# EAGLE design GUC_KATMANI (EAGLE 8.5.1)
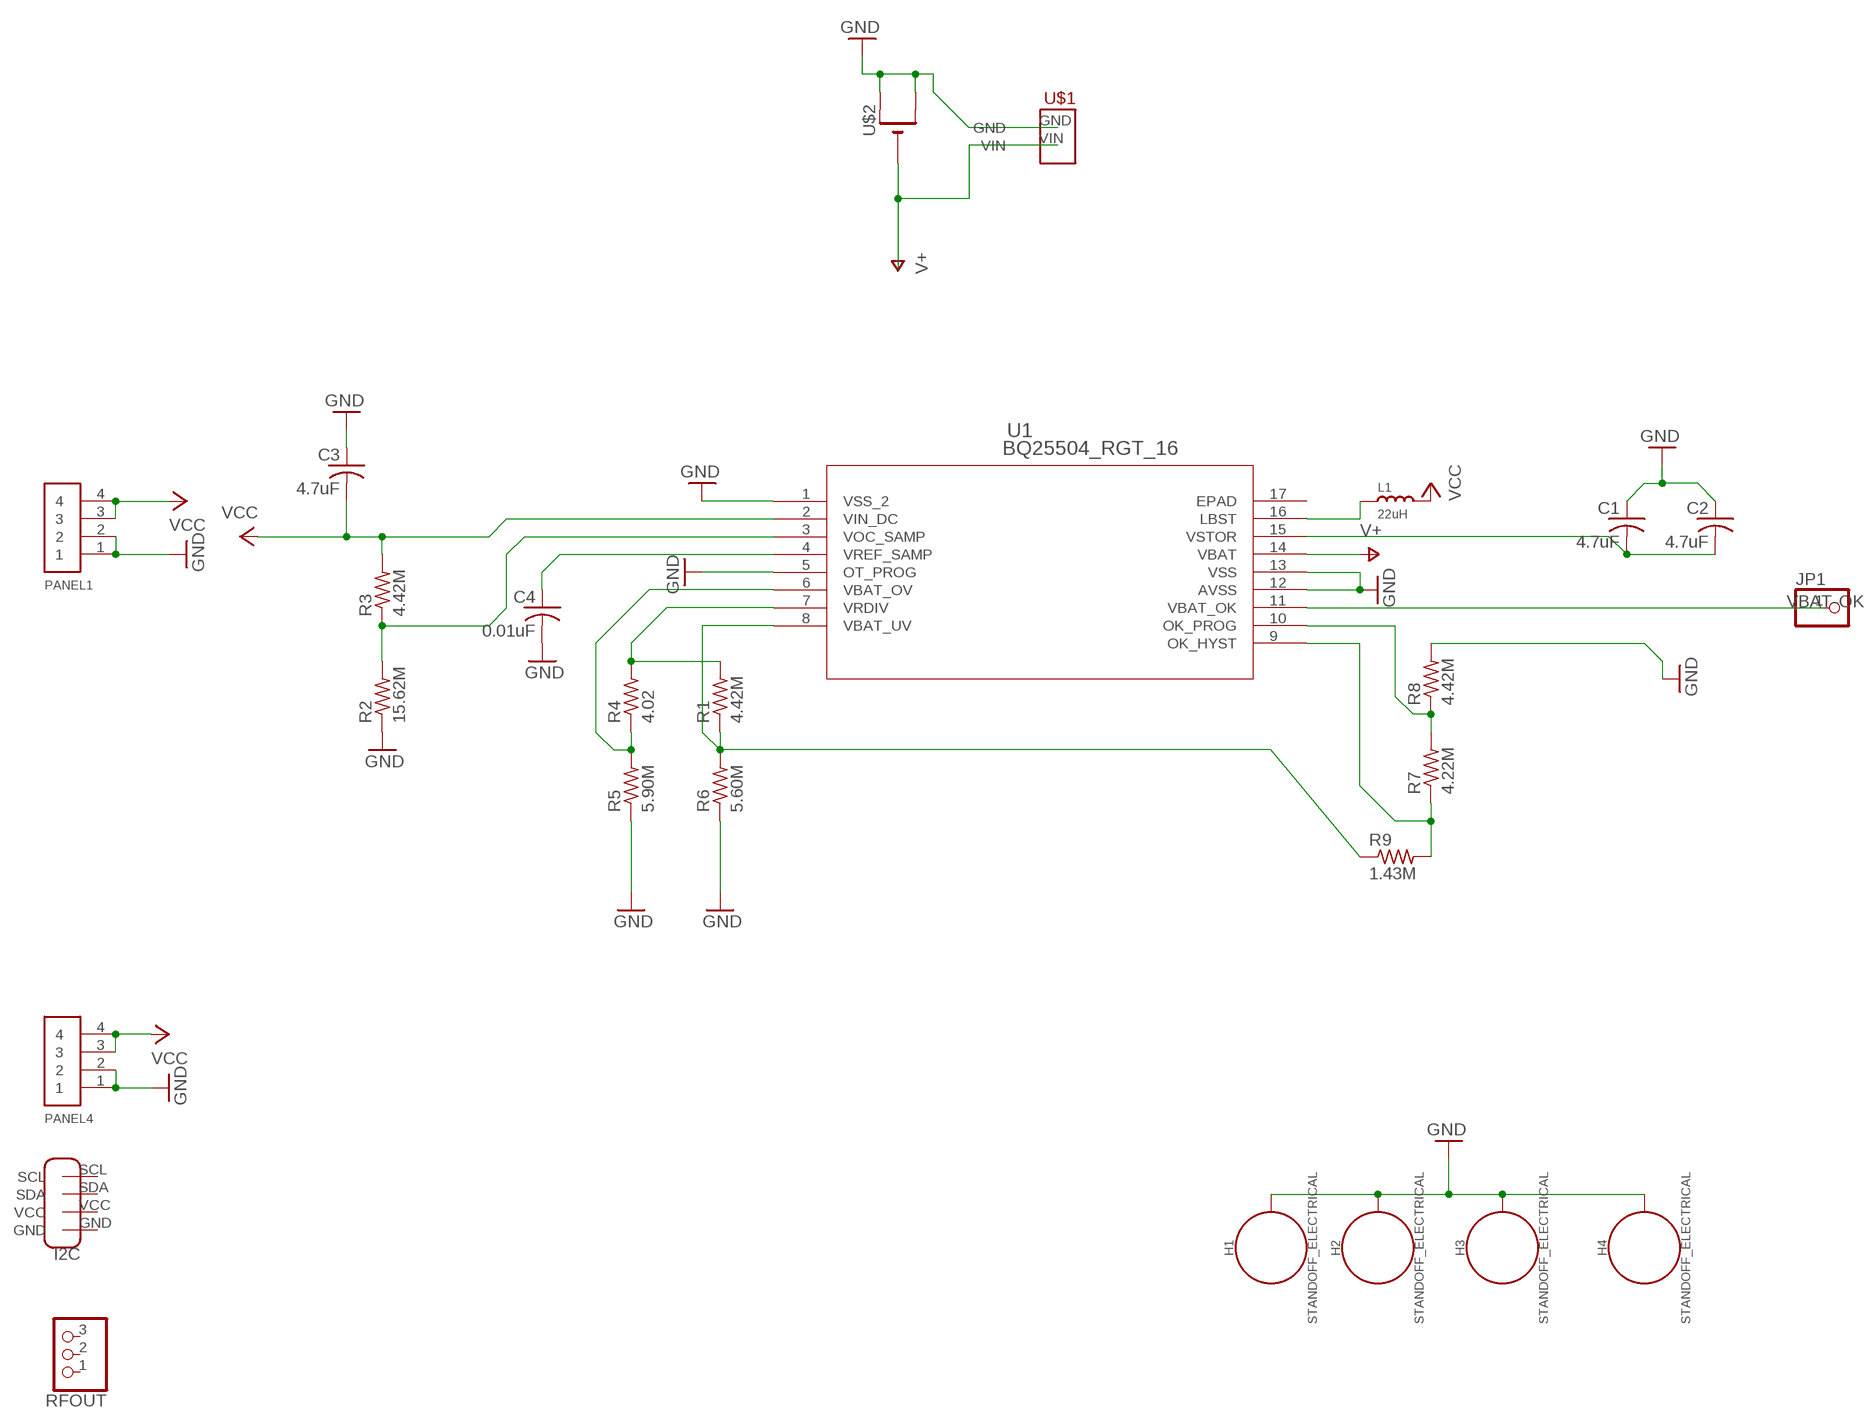
[diagram p0: schematic, sheet 1]

## Parts
C1  4.7uF  C-USC0805K  [C0805K]
C2  4.7uF  C-USC0805K  [C0805K]
C3  4.7uF  C-USC0805K  [C0805K]
C4  0.01uF  C-USC0805K  [C0805K]
H1  STANDOFF_ELECTRICAL  [STANDOFF-ELECTRICAL]
H2  STANDOFF_ELECTRICAL  [STANDOFF-ELECTRICAL]
H3  STANDOFF_ELECTRICAL  [STANDOFF-ELECTRICAL]
H4  STANDOFF_ELECTRICAL  [STANDOFF-ELECTRICAL]
JP1  PINHD-1X1CB  [1X01-CLEANBIG]
L1  22uH  SMD-FERRITE-BEAD-330R-1500MA(0805)'0805'  [L0805]
PANEL1  1X4-CLEANBIG  [1X04-CLEANBIG]
PANEL4  1X4-CLEANBIG  [1X04-CLEANBIG]
R1  4.42M  R-US_R0805  [R0805]
R2  15.62M  R-US_R0805  [R0805]
R3  4.42M  R-US_R0805  [R0805]
R4  4.02  R-US_R0805  [R0805]
R5  5.90M  R-US_R0805  [R0805]
R6  5.60M  R-US_R0805  [R0805]
R7  4.22M  R-US_R0805  [R0805]
R8  4.42M  R-US_R0805  [R0805]
R9  1.43M  R-US_R0805  [R0805]
RFOUT  PINHD-1X3CB  [1X03-CLEANBIG]
U1  BQ25504_RGT_16  [RGT16_1P7X1P7]
U$1  2PINKLEMENS  [2PINKLEMENS]
U$2  CR1220SMT  [CR1220-SMD]
U$3  I2C  [I2C]

## Nets
GND: C1.1 C2.1 C3.1 C4.2 H1.P1 H2.P1 H3.P1 H4.P1 PANEL1.1 PANEL1.2 PANEL4.1 PANEL4.2 R2.1 R5.1 R6.1 R8.2 U1.1(VSS_2) U1.5(OT_PROG) U1.12(AVSS) U1.13(VSS) U$1.GND U$2.+$1(+) U$2.+$2(+1)
N$1: R2.2 R3.1 U1.3(VOC_SAMP)
N$4: C4.1 U1.4(VREF_SAMP)
N$6: R4.1 R5.2 U1.6(VBAT_OV)
N$7: R1.2 R4.2 U1.7(VRDIV)
N$8: R1.1 R6.2 R9.1 U1.8(VBAT_UV)
N$13: R7.2 R8.1 U1.10(OK_PROG)
N$16: L1.1 U1.16(LBST)
N$18: R7.1 R9.2 U1.9(OK_HYST)
N$22: C1.2 C2.2 U1.15(VSTOR)
V+: U1.14(VBAT) U$1.VIN U$2.-
VBAT-OK: JP1.1 U1.11(VBAT_OK)
VCC: C3.2 L1.2 PANEL1.3 PANEL1.4 PANEL4.3 PANEL4.4 R3.2 U1.2(VIN_DC)
Unconnected: RFOUT.1 RFOUT.2 RFOUT.3 U$3.GND U$3.SCL U$3.SDA U$3.VCC

## Power pins joined to a net without a drawn wire
EPAD: U1.17(EPAD)

## Library data of the parts
C1-C4 = adafruit:C-US: CAPACITOR, American symbol
H1-H4 = SparkFun-Hardware:STANDOFF_ELECTRICAL: Stand Off Drill holes with an electrical connection. For example, use these to ground your board to a chassis. Example SparkFun Products Screw - Phillips Head (1/4", 4-40, 10 pack) <https://www.sparkfun.com/products/10453> (PRT-10453) Screw - Phillips Head (1/2", 4-40, 10 pack) <https://www.sparkfun.com/products/10452> (PRT-10452) Screw - Phillips Head (3/4", 4-40, 10 pack) <https://www.sparkfun.com/products/10451> (PRT-10451) Screw - Phillips Head (1", 4-40, 10 pack) <https://www.sparkfun.com/products/10450> (PRT-10450)
JP1 = adafruit:PINHD-1X1: Pin header 1x1 for 0.1" spacing With round pins
L1 = Seeed-Inductor:SMD-FERRITE-BEAD-330R-1500MA(0805): 303030006; MPN: BLM21PG331SN1D; VALUE: 330R-1500MA
PANEL1 PANEL4 = adafruit:1X4: 4-pin connector
R1-R9 = adafruit:R-US_: RESISTOR, American symbol
RFOUT = adafruit:PINHD-1X3: PIN HEADER
U1 = BQ25504:BQ25504_RGT_16; DATASHEETURL: httpwww.ti.comlitgpnBQ25504; FAMILY_NAME: BATTERY CHARGE MANAGEMENT; GENERIC_PART_NUMBER: BQ25504; INDUSTRY_STD_PKG_TYPE: QFN; MANUFACTURER: Texas Instruments; PACKAGE_DESIGNATOR: RGT; PIN_COUNT: 16
U$1 = 0000000111111aaa:2PINKLEMENS: 2 pin klemens denemem
U$2 = adafruit:CR1220: CR1216/CR1220/CR1225 12mm 3V lithium coin cell Great for battery packup. Both SMT and THM holders. Note the THM package has the ground pads on both sides of the PCB so that the masks are the same - this reduces the cost
U$3 = 0000000111111aaa:I2C

## Board
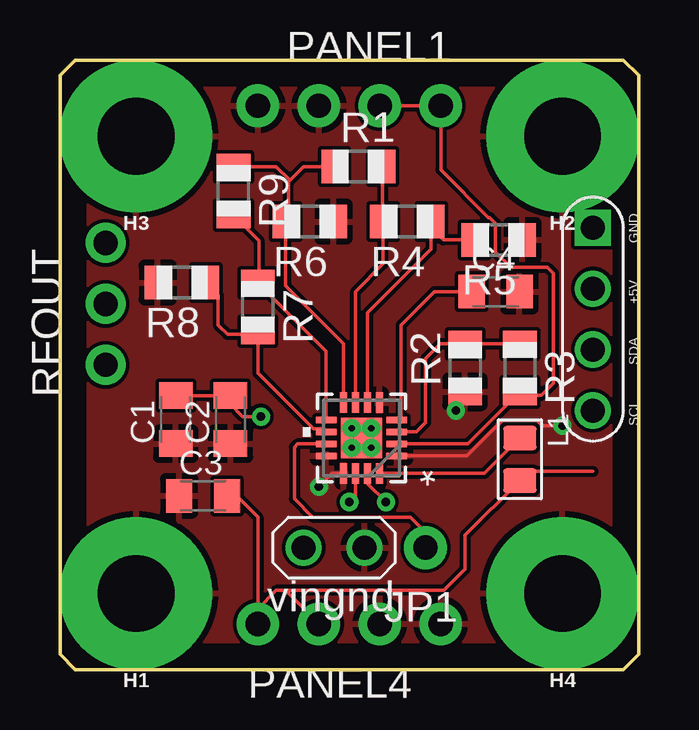
[diagram p1: board, top side]
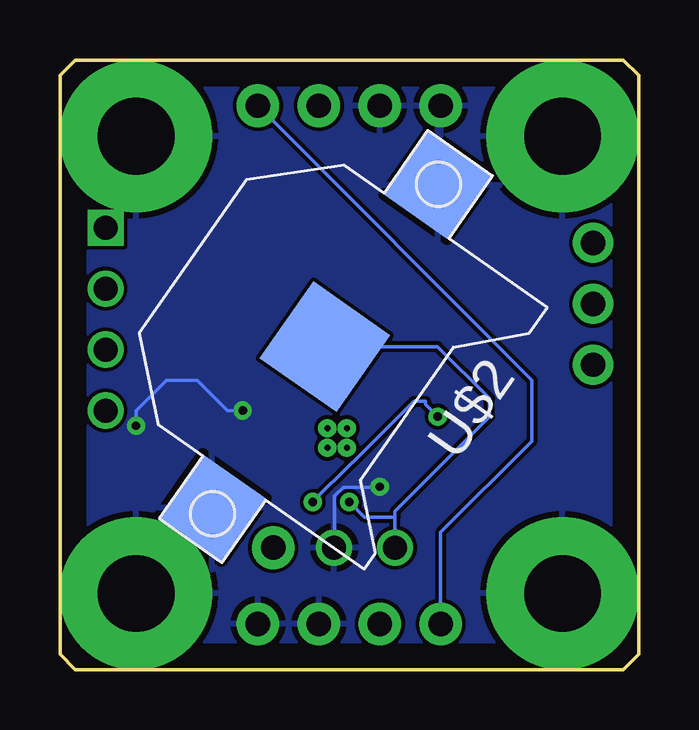
[diagram p2: board, bottom side, seen from below]

Size 24.13 x 25.4 mm. Coordinates in mm from the lower left corner, seen from the top.
Outline: 24.13,0.63 23.5,0 0.63,0 0,0.63 0,24.77 0.63,25.4 23.5,25.4 24.13,24.77 24.13,0.63
Copper layers (1*16): Top 0.035mm / dielectric 1.5mm / Bottom 0.035mm
Design rules "default": minimum track width 6mil, minimum drill 0.35mm, track to track 6mil, track to pad 6mil, pad to pad 6mil, via to via 6mil, smd to smd 6mil, copper to edge 40mil, drill to drill 6mil, minimum pad ring 10mil, minimum via ring 8mil, stop-mask expansion 4mil, vias tented up to drill 0mil, thermal gap 10mil

### Footprints (pad centres in the part's own frame; a part is rotated, then mirrored left to right if it is on the bottom)
C0805K = smd 1.1 x 1.4: 1 -1,0; 2 1,0
STANDOFF-ELECTRICAL = drill 3.2 pad 6.35: P1 0,0
1X01-CLEANBIG = drill 1.016 pad 1.778: 1 0,0
L0805 = smd 1.016 x 1.397: 1 -0.889,0; 2 0.889,0
1X04-CLEANBIG = drill 1.016 pad 1.778: 1 -3.81,0; 2 -1.27,0; 3 1.27,0; 4 3.81,0
R0805 = smd 1.1 x 1.4: 1 -1,0; 2 1,0
1X03-CLEANBIG = drill 1.016 pad 1.676: 1 -2.54,0; 2 0,0; 3 2.54,0
RGT16_1P7X1P7 = smd 0.85 x 0.28: 1 -1.475,0.75; 2 -1.475,0.25; 3 -1.475,-0.25; 4 -1.475,-0.75; 9 1.475,-0.75; 10 1.475,-0.25; 11 1.475,0.25; 12 1.475,0.75 | smd 0.28 x 0.85: 5 -0.75,-1.475; 6 -0.25,-1.475; 7 0.25,-1.475; 8 0.75,-1.475; 13 0.75,1.475; 14 0.25,1.475; 15 -0.25,1.475; 16 -0.75,1.475 | smd 1.7 x 1.7: 17 0,0 | drill 0.254 pad 0.508: V -0.406,-0.406; V_1 -0.406,0.406; V_2 0.406,-0.406; V_3 0.406,0.406
2PINKLEMENS = drill 1: GND 1.27,0; VIN -1.27,0
CR1220-SMD = smd 3.2 x 3.2: +$1 -8.2,0; +$2 8.2,0 | smd 3.9 x 3.9: - 0,0
I2C = drill 1 square: GND -2.54,0 | drill 1: SCL 5.08,0; SDA 2.54,0; VCC 0,0

### Placement (x,y rotation side)
C1  4.83,10.41 90 top
C2  7.11,10.41 90 top
C3  5.97,7.24 0 top
C4  18.16,15.75 0 top
H1  3.17,3.18 180 top
H2  20.95,22.22 180 top
H3  3.17,22.22 180 top
H4  20.95,3.18 180 top
JP1  15.24,5.08 180 top
L1  19.18,8.76 270 top
PANEL1  12.06,23.5 0 top
PANEL4  12.06,1.91 180 top
R1  12.45,20.95 0 top
R2  16.89,12.57 90 top
R3  19.18,12.57 270 top
R4  14.48,18.67 180 top
R5  18.29,17.91 180 top
R6  10.41,18.67 180 top
R7  8.26,15.11 270 top
R8  5.08,16.13 180 top
R9  7.24,19.94 270 top
RFOUT  1.91,15.24 90 top
U1  12.57,9.65 180 top
U$1  11.43,5.08 0 top
U$2  13.08,13.46 235 bottom
U$3  22.23,15.88 270 top

### Tracks (layer width: path | path; a pad name or v marks a point on that pad's centre or on a via)
GND  (via drill 0.35)
  Top 0.152: U1.13 11.35,8.18 v10.8,7.62 | v20.95,10.16 20.12,10.16 19.9,10.39 18.46,10.39 16.97,8.9 U1.1 | R2.1 16.51,11.19 v16.51,10.8
  Bottom 0.152: U$1.GND 12.67,5.11 12.67,7.24 12.32,7.59 10.82,7.59 v10.8,7.62 | v16.51,10.8 17.14,10.8 18.41,12.06 19.69,12.06 20.95,10.8 v20.95,10.16
  pour Bottom: 24.13,0.63 23.5,0 0.63,0 0,0.63 0,24.77 0.63,25.4 23.5,25.4 24.13,24.77
  pour Top: 24.13,0.63 23.5,0 0.63,0 0,0.63 0,24.77 0.63,25.4 23.5,25.4 24.13,24.77
N$1
  Top 0.152: U1.3 14.85,9.9 15.24,10.29 15.24,12.95 15.86,13.57 R2.2 R3.1
N$4
  Top 0.152: C4.1 15.62,15.75 14.22,14.35 14.22,10.58 U1.4
N$6
  Top 0.152: R4.1 15.48,18.42 | 15.48,18.42 15.48,17.51 12.83,14.86 U1.6 | R5.2 15.99,17.91 15.48,18.42
N$7
  Top 0.152: U1.7 12.32,15.75 13.48,16.91 R4.2 13.45,18.7 R1.2
N$8
  Top 0.152: 9.59,20.38 9.52,20.32 9.52,18.78 R6.2 9.41,15.99 11.82,13.58 U1.8 | 9.59,20.38 10.16,20.95 R1.1 | 9.59,20.38 9.02,20.95 7.26,20.95 R9.1
N$13
  Top 0.152: U1.10 10.97,10.03 10.58,10.03 8.26,12.36 8.26,13.97 | 8.26,13.97 R7.2 | R8.1 6.6,15.61 6.6,14.35 6.98,13.97 8.26,13.97
N$16
  Top 0.152: U1.16 17.7,8.18 L1.1
N$18
  Top 0.152: U1.9 11.1,13.27 8.31,16.06 | 8.31,16.06 R7.1 | R9.2 8.31,17.87 8.31,16.06
N$22  (via drill 0.35)
  Top 0.152: U1.15 12.82,7.75 v13.59,6.98 | v8.38,10.54 7.62,10.54 7.11,11.05 C2.2 C1.2
  Bottom 0.152: v13.59,6.98 11.94,8.64 11.91,8.64 9.37,11.18 8.89,11.18 8.89,11.05 v8.38,10.54
V+  (via drill 0.35)
  Top 0.152: U1.14 12.32,7.24 v12.06,6.98
  Bottom 0.152: U$1.VIN 10.16,6.35 | 10.16,6.35 10.16,6.6 6.22,10.54 6.22,11.3 8.38,13.46 U$2.- | v12.06,6.98 11.43,6.35 10.16,6.35
VBAT-OK
  Top 0.152: U1.11 9.91,9.4 9.78,9.27 9.78,7.11 10.54,6.35 14.6,6.35 15.24,5.72 JP1.1
VCC
  Top 0.152: U1.2 17.01,9.4 R3.2 19.32,11.43 20.07,11.43 20.57,11.94 20.57,16.51 20.32,16.76 18.8,16.76 18.16,17.4 18.16,18.61 17.93,18.84 17.87,18.84 15.88,20.83 PANEL1.4 PANEL1.3 | C3.2 7.37,7.24 8.26,6.35 8.26,2.54 | 9.52,3.3 16,3.3 16.89,4.19 16.89,5.59 L1.2 19.56,8.26 22.23,8.26 | 9.52,3.3 9.02,3.3 8.26,2.54 | 8.26,2.54 PANEL4.4 | PANEL4.3 9.52,3.18 9.52,3.3
  Bottom 0.152: PANEL4.4 8.26,5.72 4.45,9.52 4.45,12.06 PANEL1.4